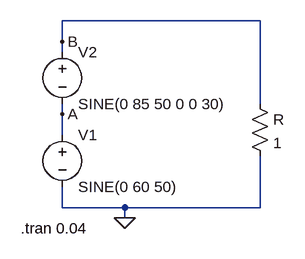
[diagram p0: schematic Draft1.asc]
Draft1.asc, the LTspice schematic file:
Version 4
SHEET 1 952 680
WIRE 912 0 608 0
WIRE 608 32 608 0
WIRE 608 48 608 32
WIRE 912 128 912 0
WIRE 608 144 608 128
WIRE 608 176 608 144
WIRE 608 288 608 256
WIRE 704 288 608 288
WIRE 912 288 912 208
WIRE 912 288 704 288
WIRE 704 304 704 288
FLAG 704 304 0
FLAG 608 144 A
FLAG 608 32 B
SYMBOL voltage 608 160 R0
WINDOW 123 0 0 Left 0
WINDOW 39 0 0 Left 0
SYMATTR InstName V1
SYMATTR Value SINE(0 60 50)
SYMBOL voltage 608 32 R0
WINDOW 123 0 0 Left 0
WINDOW 39 0 0 Left 0
SYMATTR InstName V2
SYMATTR Value SINE(0 85 50 0 0 30)
SYMBOL res 896 112 R0
SYMATTR InstName R
SYMATTR Value 1
TEXT 544 320 Left 2 !.tran 0.04

The netlist it stands for:
* Draft1.asc
V1 A 0 SINE(0 60 50)
V2 B A SINE(0 85 50 0 0 30)
R B 0 1
.tran 0.04
.backanno
.end

* Results of the author's LTspice run, read from the files saved beside the schematic
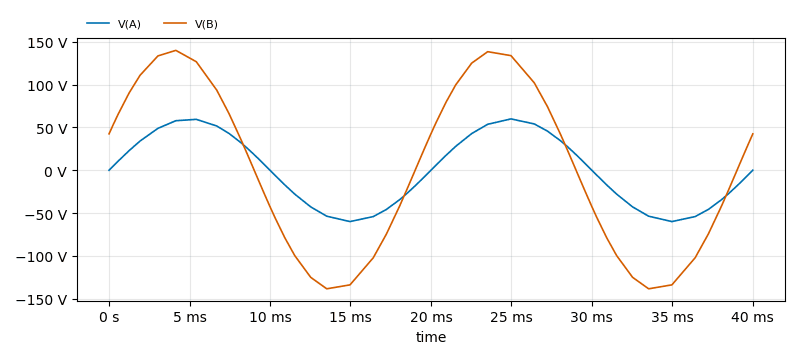
[diagram p1: Transient Analysis of Draft1.asc, plotted from the saved traces]
* Transient Analysis, 1 run:
*   V(A): min -59.98 V, max 59.98 V, average 14.86 mV, rms 42.09 V, last 0 V
*   V(B): min -138.5 V, max 140.1 V, average 33.5 mV, rms 98.42 V, last 42.5 V